# EAGLE design Mainboard_V1 (EAGLE 7.6.0)

## Sheet 1 of 2
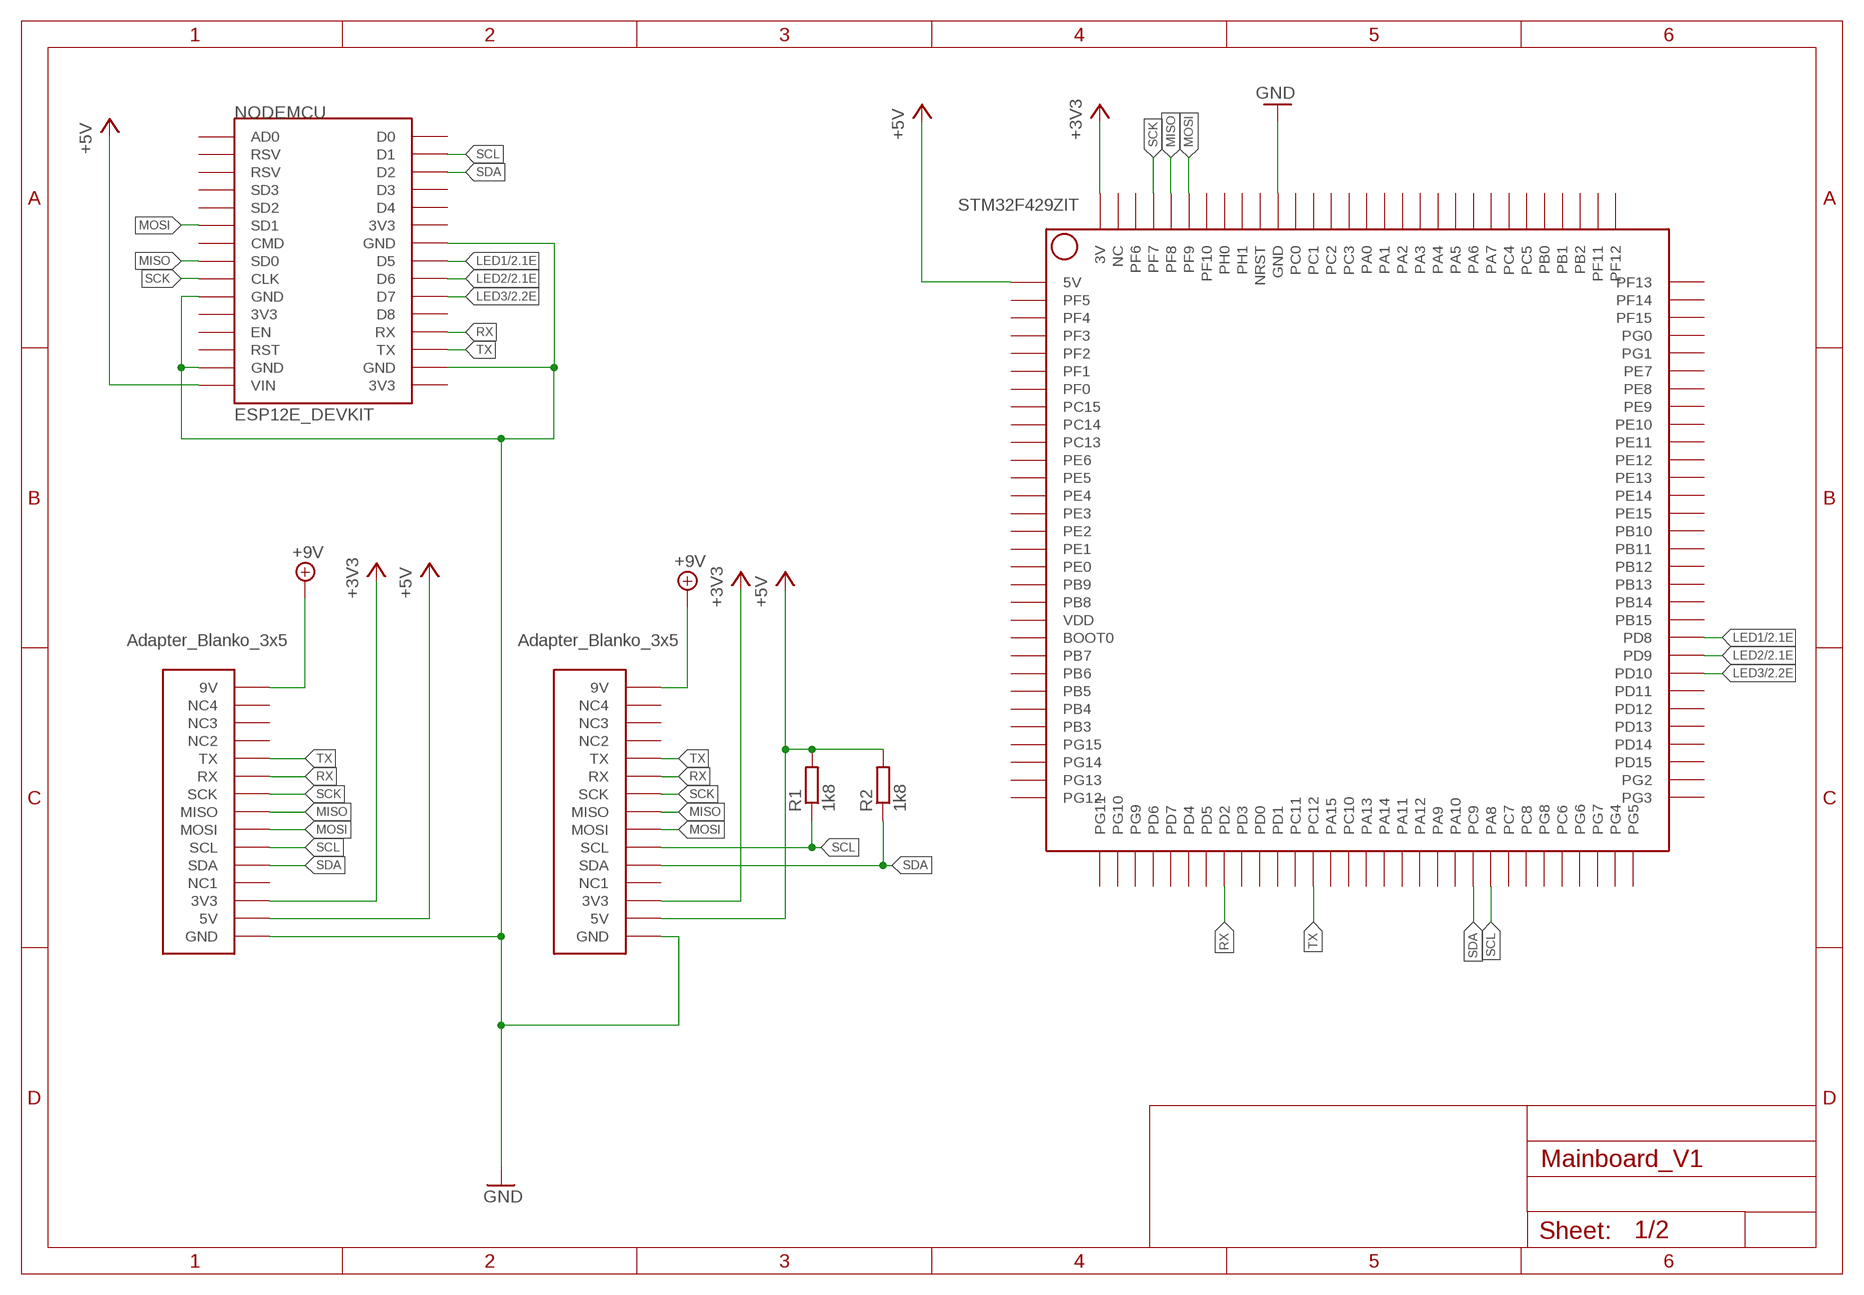
[diagram p0: schematic, sheet 1]

### Parts
NODEMCU  ESP12E_DEVKIT  [ESP12E_DEVKIT]
R1  1k8  R-EU_R0805  [R0805]
R2  1k8  R-EU_R0805  [R0805]
U$1  STM32F429ZIT  [STM32F429ZIT]
U$2  ADAPTER_BLANKO_3X5B1  [ADAPTER_BLANKO_3X5_B1]
U$3  ADAPTER_BLANKO_3X5B1  [ADAPTER_BLANKO_3X5_B1]

### Nets
+3V3: U$1.3V U$1.3V1(3V) U$2.3V3 U$2.3V3_1(3V3) U$3.3V3 U$3.3V3_1(3V3) ; also sheet 2
+5V: NODEMCU.VIN R1.2 R2.2 U$1.5V U$1.5V1(5V) U$2.5V U$2.5V_1(5V) U$3.5V U$3.5V_1(5V) ; also sheet 2
+9V: U$2.9V U$2.9V_1(9V) U$3.9V U$3.9V_1(9V) ; also sheet 2
GND: NODEMCU.GND@0(GND) NODEMCU.GND@1(GND) NODEMCU.GND@2(GND) NODEMCU.GND@3(GND) U$1.GND U$1.GND1(GND) U$1.GND2(GND) U$1.GND3(GND) U$1.GND4(GND) U$1.GND5(GND) U$2.GND U$2.GND1(GND) U$2.GND2(GND) U$2.GND3(GND) U$3.GND U$3.GND1(GND) U$3.GND2(GND) U$3.GND3(GND) ; also sheet 2
LED1: NODEMCU.D5 U$1.PD8 ; also sheet 2
LED2: NODEMCU.D6 U$1.PD9 ; also sheet 2
LED3: NODEMCU.D7 U$1.PD10 ; also sheet 2
MISO: NODEMCU.SD0 U$1.PF8 U$2.MISO U$2.MISO_1(MISO) U$3.MISO U$3.MISO_1(MISO)
MOSI: NODEMCU.SD1 U$1.PF9 U$2.MOSI U$2.MOSI_1(MOSI) U$3.MOSI U$3.MOSI_1(MOSI)
RX: NODEMCU.RX U$1.PD2 U$2.RX U$2.RX_1(RX) U$3.RX U$3.RX_1(RX)
SCK: NODEMCU.CLK U$1.PF7 U$2.SCK U$2.SCK_1(SCK) U$3.SCK U$3.SCK_1(SCK)
SCL: NODEMCU.D1 R1.1 U$1.PA8 U$2.SCL U$2.SCL_1(SCL) U$3.SCL U$3.SCL_1(SCL)
SDA: NODEMCU.D2 R2.1 U$1.PC9 U$2.SDA U$2.SDA_1(SDA) U$3.SDA U$3.SDA_1(SDA)
TX: NODEMCU.TX U$1.PC12 U$2.TX U$2.TX_1(TX) U$3.TX U$3.TX_1(TX)
Unconnected: NODEMCU.3V3@0(3V3) NODEMCU.3V3@1(3V3) NODEMCU.3V3@2(3V3) NODEMCU.AD0 NODEMCU.CMD NODEMCU.D0 NODEMCU.D3 NODEMCU.D4 NODEMCU.D8 NODEMCU.EN NODEMCU.RST NODEMCU.RSV@0(RSV) NODEMCU.RSV@1(RSV) NODEMCU.SD2 NODEMCU.SD3 U$1.BOOT0 U$1.NC U$1.NRST U$1.PA0 U$1.PA1 U$1.PA2 U$1.PA3 U$1.PA4 U$1.PA5 U$1.PA6 U$1.PA7 U$1.PA9 U$1.PA10 U$1.PA11 U$1.PA12 U$1.PA13 U$1.PA14 U$1.PA15 U$1.PB0 U$1.PB1 U$1.PB2 U$1.PB3 U$1.PB4 U$1.PB5 U$1.PB6 U$1.PB7 U$1.PB8 U$1.PB9 U$1.PB10 U$1.PB11 U$1.PB12 U$1.PB13 U$1.PB14 U$1.PB15 U$1.PC0 U$1.PC1 U$1.PC2 U$1.PC3 U$1.PC4 U$1.PC5 U$1.PC6 U$1.PC7 U$1.PC8 U$1.PC10 U$1.PC11 U$1.PC13 U$1.PC14 U$1.PC15 U$1.PD0 U$1.PD1 U$1.PD3 U$1.PD4 U$1.PD5 U$1.PD6 U$1.PD7 U$1.PD11 U$1.PD12 U$1.PD13 U$1.PD14 U$1.PD15 U$1.PE0 U$1.PE1 U$1.PE2 U$1.PE3 U$1.PE4 U$1.PE5 U$1.PE6 U$1.PE7 U$1.PE8 U$1.PE9 U$1.PE10 U$1.PE11 U$1.PE12 U$1.PE13 U$1.PE14 U$1.PE15 U$1.PF0 U$1.PF1 U$1.PF2 U$1.PF3 U$1.PF4 U$1.PF5 U$1.PF6 U$1.PF10 U$1.PF11 U$1.PF12 U$1.PF13 U$1.PF14 U$1.PF15 U$1.PG0 U$1.PG1 U$1.PG2 U$1.PG3 U$1.PG4 U$1.PG5 U$1.PG6 U$1.PG7 U$1.PG8 U$1.PG9 U$1.PG10 U$1.PG11 U$1.PG12 U$1.PG13 U$1.PG14 U$1.PG15 U$1.PH0 U$1.PH1 U$1.VDD U$2.NC1 U$2.NC2 U$2.NC3 U$2.NC4 U$2.NC5(NC1) U$2.NC6(NC2) U$2.NC7(NC3) U$2.NC8(NC4) U$3.NC1 U$3.NC2 U$3.NC3 U$3.NC4 U$3.NC5(NC1) U$3.NC6(NC2) U$3.NC7(NC3) U$3.NC8(NC4)

## Sheet 2 of 2
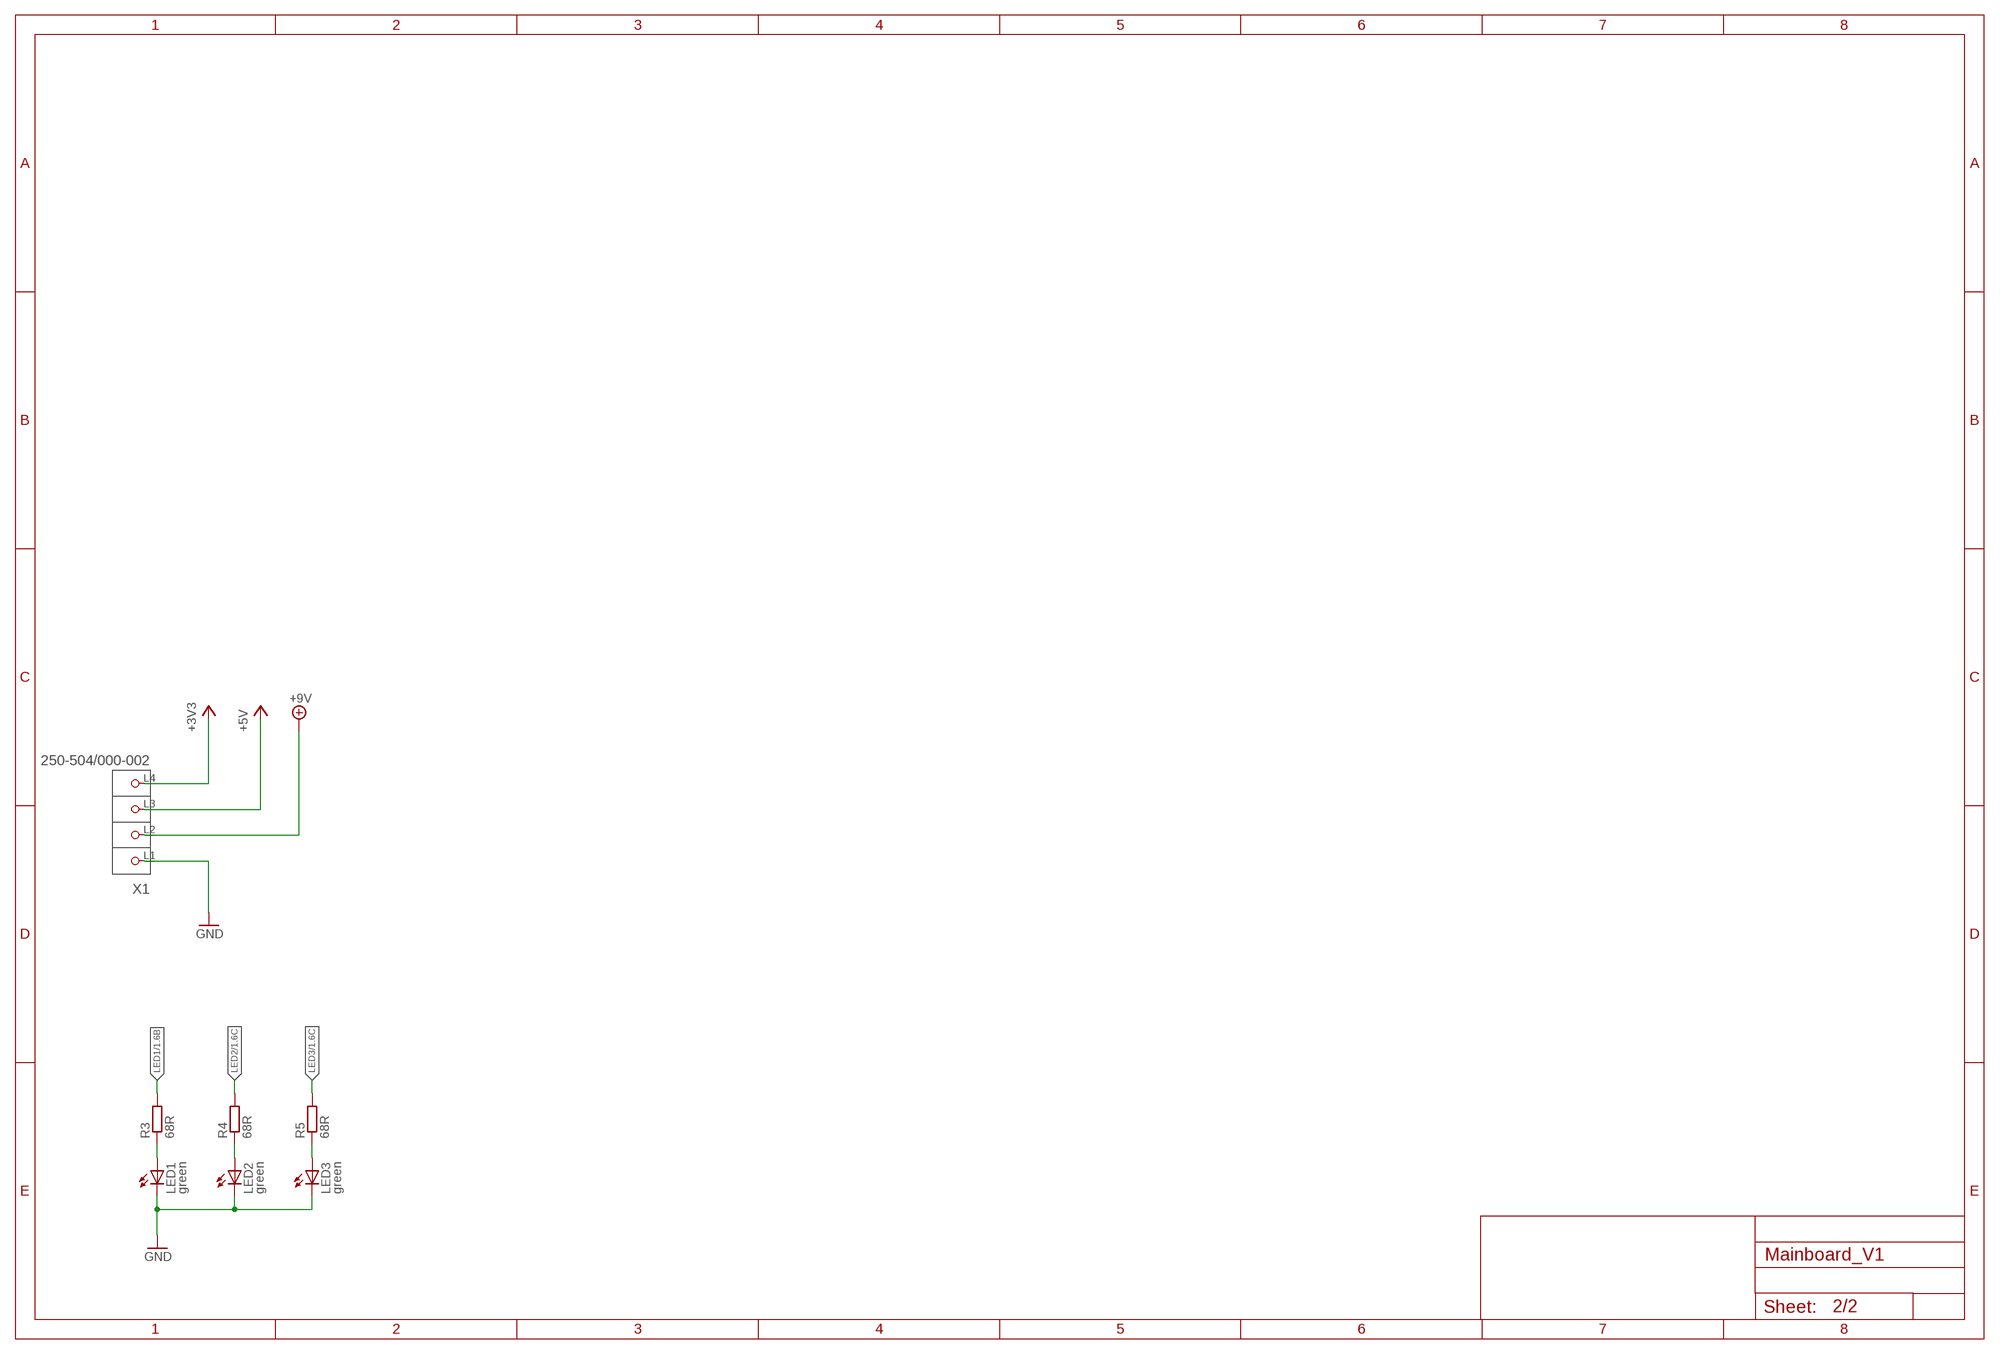
[diagram p1: schematic, sheet 2]

### Parts
LED1  green  LEDCHIP-LED0805  [CHIP-LED0805]
LED2  green  LEDCHIP-LED0805  [CHIP-LED0805]
LED3  green  LEDCHIP-LED0805  [CHIP-LED0805]
R3  68R  R-EU_R0805W  [R0805W]
R4  68R  R-EU_R0805W  [R0805W]
R5  68R  R-EU_R0805W  [R0805W]
X1  250-504/000-002  [P-250-504]

### Nets
+3V3: X1.L4(P4) ; also sheet 1
+5V: X1.L3(P3) ; also sheet 1
+9V: X1.L2(P2) ; also sheet 1
GND: LED1.C LED2.C LED3.C X1.L1(P1) ; also sheet 1
LED1: R3.2 ; also sheet 1
LED2: R4.2 ; also sheet 1
LED3: R5.2 ; also sheet 1
N$1: LED1.A R3.1
N$2: LED2.A R4.1
N$3: LED3.A R5.1

## Library data of the parts
LED1-LED3 = led:LED: LED OSRAM: - CHIPLED LG R971, LG N971, LY N971, LG Q971, LY Q971, LO R971, LY R971 LH N974, LH R974 LS Q976, LO Q976, LY Q976 LO Q996 - Hyper CHIPLED LW Q18S LB Q993, LB Q99A, LB R99A - SideLED LS A670, LO A670, LY A670, LG A670, LP A670 LB A673, LV A673, LT A673, LW A673 LH A674 LY A675 LS A676, LA A676, LO A676, LY A676, LW A676 LS A679, LY A679, LG A679 - Hyper Micro SIDELED® LS Y876, LA Y876, LO Y876, LY Y876 LT Y87S - SmartLED LW L88C, LW L88S LB L89C, LB L89S, LG L890 LS L89K, LO L89K, LY L89K LS L896, LA L896, LO L896, LY L896 - TOPLED LS T670, LO T670, LY T670, LG T670, LP T670 LSG T670, LSP T670, LSY T670, LOP T670, LYG T670 LG T671, LOG T671, LSG T671 LB T673, LV T673, LT T673, LW T673 LH T674 LS T676, LA T676, LO T676, LY T676, LB T676, LH T676, LSB T676, LW T676 LB T67C, LV T67C, LT T67C, LS T67K, LO T67K, LY T67K, LW E67C LS E67B, LA E67B, LO E67B, LY E67B, LB E67C, LV E67C, LT E67C LW T67C LS T679, LY T679, LG T679 LS T770, LO T770, LY T770, LG T770, LP T770 LB T773, LV T773, LT T773, LW T773 LH T774 LS E675, LA E675, LY E675, LS T675 LS T776, LA T776, LO T776, LY T776, LB T776 LHGB T686 LT T68C, LB T68C - Hyper Mini TOPLED® LB M676 - Mini TOPLED Santana® LG M470 LS M47K, LO M47K, LY M47K Source: http://www.osram.convergy.de LUXEON: - LUMILED® LXK2-PW12-R00, LXK2-PW12-S00, LXK2-PW14-U00, LXK2-PW14-V00 LXK2-PM12-R00, LXK2-PM12-S00, LXK2-PM14-U00 LXK2-PE12-Q00, LXK2-PE12-R00, LXK2-PE12-S00, LXK2-PE14-T00, LXK2-PE14-U00 LXK2-PB12-K00, LXK2-PB12-L00, LXK2-PB12-M00, LXK2-PB14-N00, LXK2-PB14-P00, LXK2-PB14-Q00 LXK2-PR12-L00, LXK2-PR12-M00, LXK2-PR14-Q00, LXK2-PR14-R00 LXK2-PD12-Q00, LXK2-PD12-R00, LXK2-PD12-S00 LXK2-PH12-R00, LXK2-PH12-S00 LXK2-PL12-P00, LXK2-PL12-Q00, LXK2-PL12-R00 Source: www.luxeon.com KINGBRIGHT: KA-3528ASYC Source: www.kingbright.com
NODEMCU = ESP12E_DEVKIT:ESP12E_DEVKIT: ESP12E DEVKIT BOARD
R1-R5 = rcl:R-EU_: RESISTOR, European symbol
U$1 = Tim:STM32F429ZIT
U$2 U$3 = Tim:ADAPTER_BLANKO_3X5: B1 = Beschriftung innen B2 = Beschriftung aussen
X1 = IDWlib:250-504/000-002: Serie 250, Stand: 01.01.2012. Die jeweils aktuellen Daten zu diesem Artikel finden Sie in unserem Produktkatalog, den Sie unter www.wago.com einsehen können. As of: 01/01/2012. Please find the newest data for this article in our product catalogue, which can be viewed under www.wago.com.

## Board
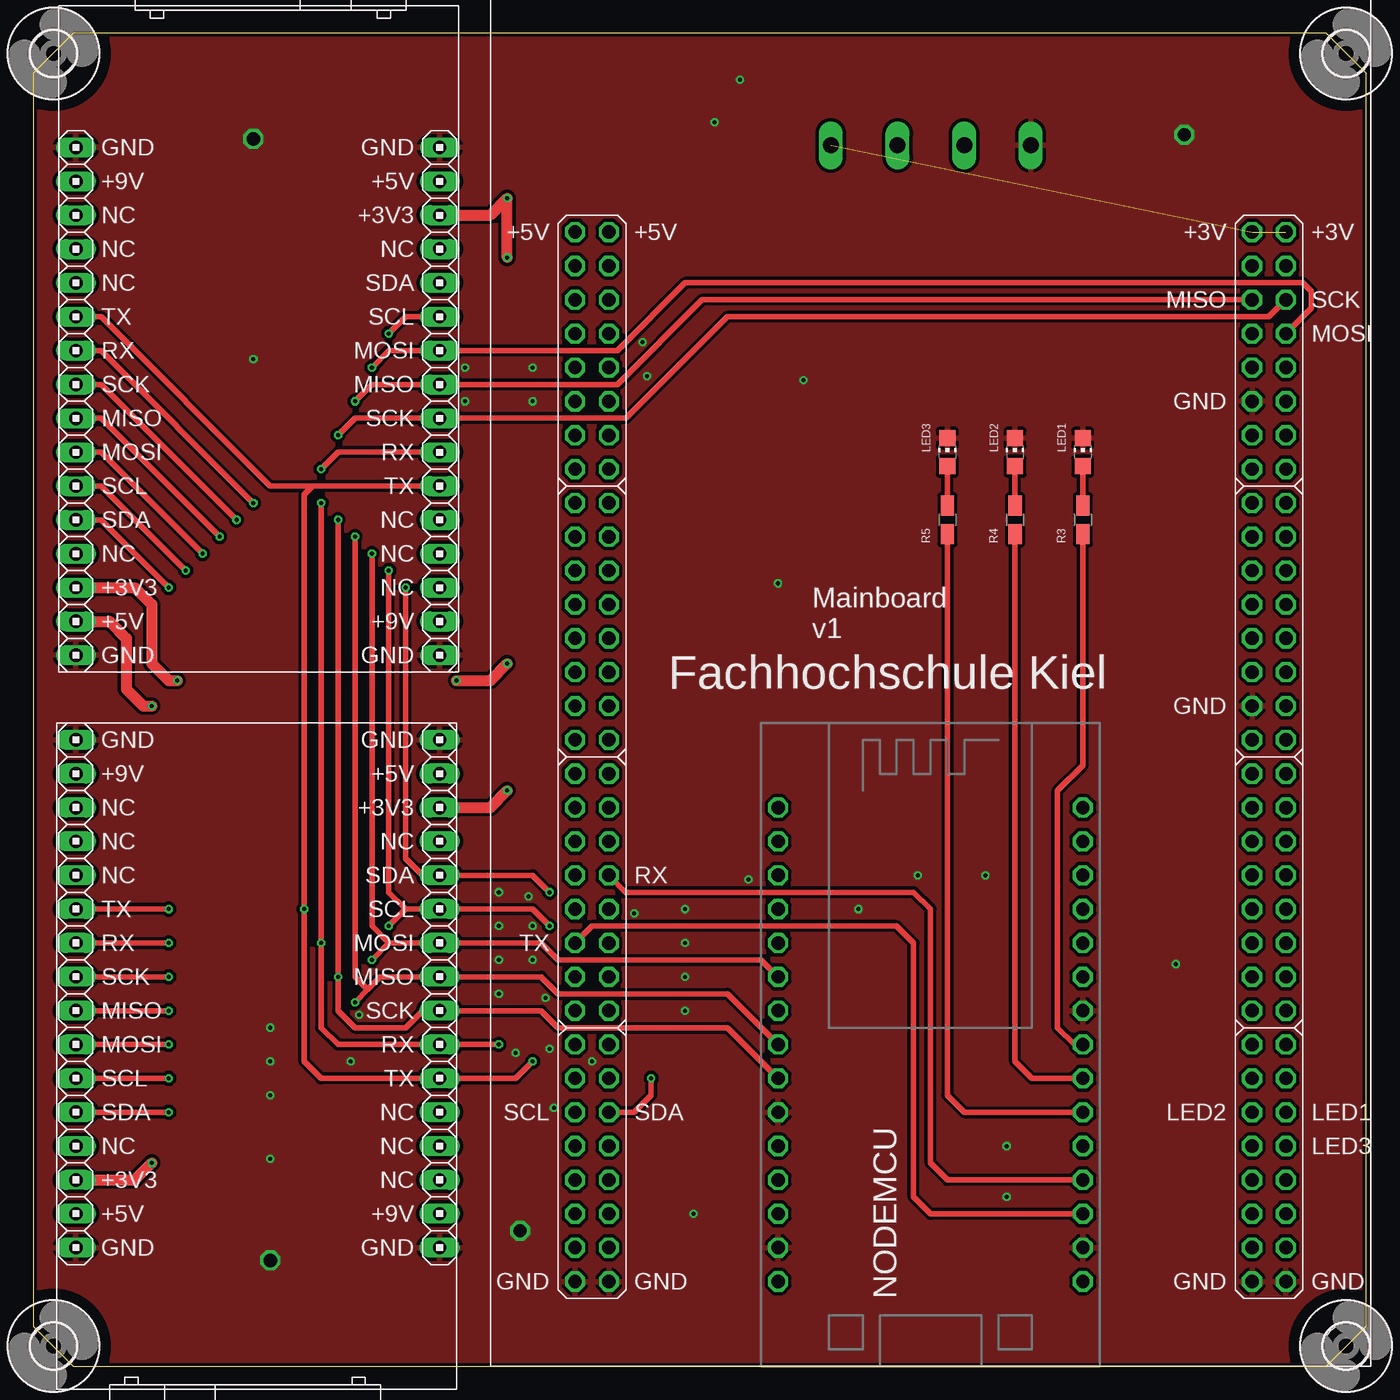
[diagram p2: board, top side]
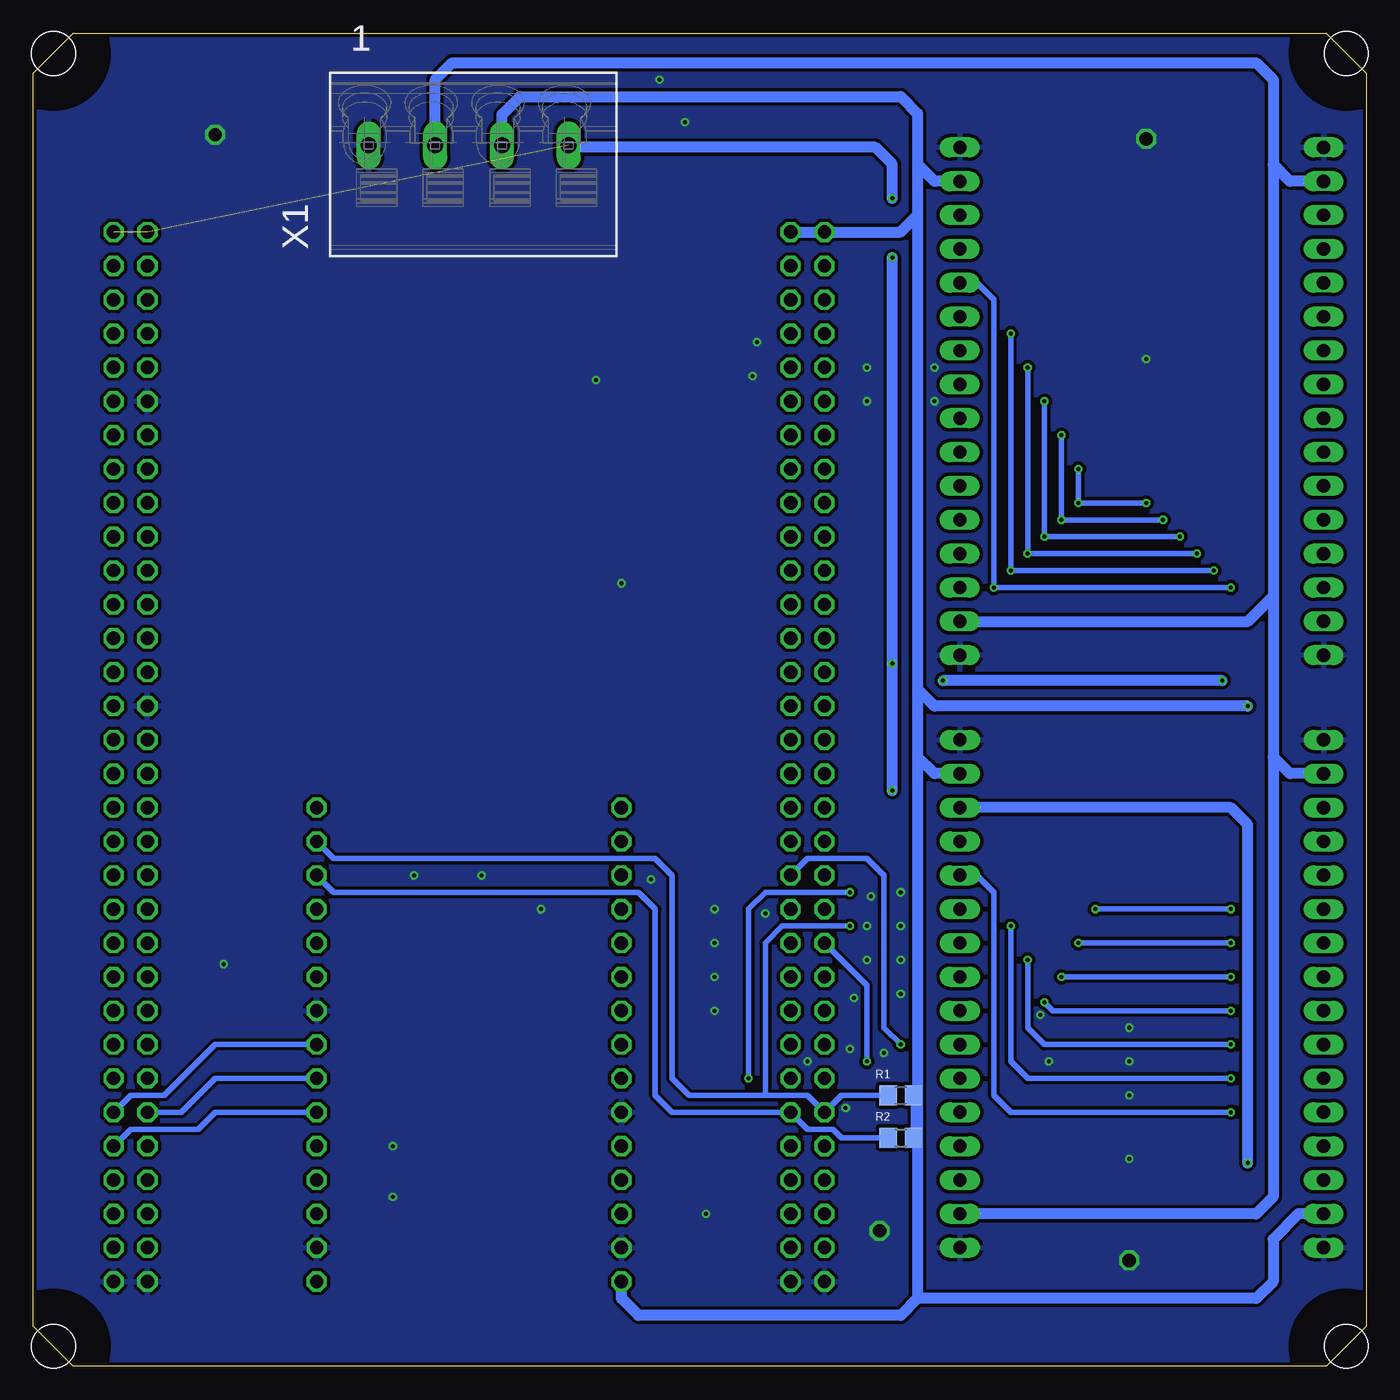
[diagram p3: board, bottom side, seen from below]

Size 100 x 100 mm. Coordinates in mm from the lower left corner, seen from the top.
Outline: 3,0 97,0 100,3 100,97 97,100 3,100 0,97 0,3 3,0
Copper layers (1*16): Top 0.035mm / dielectric 1.5mm / Bottom 0.035mm
Design rules "dirt_cheap_dirty_boards.v1": minimum track width 5mil, minimum drill 12mil, track to track 5mil, track to pad 5mil, pad to pad 5mil, via to via 5mil, smd to smd 0mil, copper to edge 10mil, drill to drill 10mil, minimum pad ring 10mil, minimum via ring 6mil, stop-mask expansion 2mil, vias tented up to drill 25mil, thermal gap 10mil

### Footprints (pad centres in the part's own frame; a part is rotated, then mirrored left to right if it is on the bottom)
CHIP-LED0805 = smd 1.2 x 1.2: A 0,-1.05; C 0,1.05
ESP12E_DEVKIT = drill 1 octagon: 3V3@0 -11.43,-7.62; 3V3@1 11.43,5.08; 3V3@2 11.43,-17.78; AD0 -11.43,17.78; CLK -11.43,-2.54; CMD -11.43,2.54; D0 11.43,17.78; D1 11.43,15.24; D2 11.43,12.7; D3 11.43,10.16; D4 11.43,7.62; D5 11.43,0; D6 11.43,-2.54; D7 11.43,-5.08; D8 11.43,-7.62; EN -11.43,-10.16; GND@0 -11.43,-5.08; GND@1 -11.43,-15.24; GND@2 11.43,2.54; GND@3 11.43,-15.24; RST -11.43,-12.7; RSV@0 -11.43,15.24; RSV@1 -11.43,12.7; RX 11.43,-10.16; SD0 -11.43,0; SD1 -11.43,5.08; SD2 -11.43,7.62; SD3 -11.43,10.16; TX 11.43,-12.7; VIN -11.43,-17.78
R0805 = smd 1.3 x 1.5: 1 -0.95,0; 2 0.95,0
R0805W = smd 1.5 x 1: 1 -1.052,0; 2 1.052,0
STM32F429ZIT = drill 1 octagon: 3V -6.35,85.089; 3V1 -8.89,85.089; 5V -59.69,85.089; 5V1 -57.15,85.089; BOOT0 -59.69,59.689; GND -59.69,6.349; GND1 -57.15,6.349; GND2 -6.35,6.349; GND3 -8.89,6.349; GND4 -8.89,49.529; GND5 -8.89,72.389; NC -6.35,82.549; NRST -6.35,72.389; PA0 -6.35,64.769; PA1 -8.89,64.769; PA2 -6.35,62.229; PA3 -8.89,62.229; PA4 -6.35,59.689; PA5 -8.89,59.689; PA6 -6.35,57.149; PA7 -8.89,57.149; PA8 -59.69,19.049; PA9 -57.15,21.589; PA10 -59.69,21.589; PA11 -57.15,24.129; PA12 -59.69,24.129; PA13 -57.15,26.669; PA14 -59.69,26.669; PA15 -57.15,29.209; PB0 -6.35,52.069; PB1 -8.89,52.069; PB2 -6.35,49.529; PB3 -57.15,52.069; PB4 -59.69,54.609; PB5 -57.15,54.609; PB6 -59.69,57.149; PB7 -57.15,57.149; PB8 -59.69,62.229; PB9 -57.15,62.229; PB10 -6.35,26.669; PB11 -8.89,26.669; PB12 -6.35,24.129; PB13 -8.89,24.129; PB14 -6.35,21.589; PB15 -8.89,21.589; PC0 -6.35,69.849; PC1 -8.89,69.849; PC2 -6.35,67.309; PC3 -8.89,67.309; PC4 -6.35,54.609; PC5 -8.89,54.609; PC6 -59.69,13.969; PC7 -57.15,16.509; PC8 -59.69,16.509; PC9 -57.15,19.049; PC10 -59.69,29.209; PC11 -57.15,31.749; PC12 -59.69,31.749; PC13 -57.15,72.389; PC14 -59.69,74.929; PC15 -57.15,74.929; PD0 -57.15,34.289; PD1 -59.69,34.289; PD2 -57.15,36.829; PD3 -59.69,36.829; PD4 -57.15,39.369; PD5 -59.69,39.369; PD6 -57.15,41.909; PD7 -59.69,41.909; PD8 -6.35,19.049; PD9 -8.89,19.049; PD10 -6.35,16.509; PD11 -8.89,16.509; PD12 -6.35,13.969; PD13 -8.89,13.969; PD14 -6.35,11.429; PD15 -8.89,11.429; PE0 -59.69,64.769; PE1 -57.15,64.769; PE2 -59.69,67.309; PE3 -57.15,67.309; PE4 -59.69,69.849; PE5 -57.15,69.849; PE6 -59.69,72.389; PE7 -8.89,39.369; PE8 -6.35,36.829; PE9 -8.89,36.829; PE10 -6.35,34.289; PE11 -8.89,34.289; PE12 -6.35,31.749; PE13 -8.89,31.749; PE14 -6.35,29.209; PE15 -8.89,29.209; PF0 -59.69,77.469; PF1 -57.15,77.469; PF2 -59.69,80.009; PF3 -57.15,80.009; PF4 -59.69,82.549; PF5 -57.15,82.549; PF6 -8.89,82.549; PF7 -6.35,80.009; PF8 -8.89,80.009; PF9 -6.35,77.469; PF10 -8.89,77.469; PF11 -6.35,46.989; PF12 -8.89,46.989; PF13 -6.35,44.449; PF14 -8.89,44.449; PF15 -6.35,41.909; PG0 -8.89,41.909; PG1 -6.35,39.369; PG2 -6.35,8.889; PG3 -8.89,8.889; PG4 -57.15,8.889; PG5 -59.69,8.889; PG6 -57.15,11.429; PG7 -59.69,11.429; PG8 -57.15,13.969; PG9 -59.69,44.449; PG10 -57.15,44.449; PG11 -59.69,46.989; PG12 -57.15,46.989; PG13 -59.69,49.529; PG14 -57.15,49.529; PG15 -59.69,52.069; PH0 -6.35,74.929; PH1 -8.89,74.929; VDD -57.15,59.689
ADAPTER_BLANKO_3X5_B1 = drill 1 long: 3V3 1.278,6.349; 3V3_1 28.566,34.289; 5V 1.278,3.809; 5V_1 28.566,36.829; 9V 1.278,36.829; 9V_1 28.566,3.809; GND 1.278,1.269; GND1 1.278,39.369; GND2 28.566,39.369; GND3 28.566,1.269; MISO 1.278,19.049; MISO_1 28.566,21.589; MOSI 1.278,16.509; MOSI_1 28.566,24.129; NC1 1.278,8.889; NC2 1.278,29.209; NC3 1.278,31.749; NC4 1.278,34.289; NC5 28.566,31.749; NC6 28.566,11.429; NC7 28.566,8.889; NC8 28.566,6.349; RX 1.278,24.129; RX_1 28.566,16.509; SCK 1.278,21.589; SCK_1 28.566,19.049; SCL 1.278,13.969; SCL_1 28.566,26.669; SDA 1.278,11.429; SDA_1 28.566,29.209; TX 1.278,26.669; TX_1 28.566,13.969
3,3 = hole 3.3: 0,0
P-250-504 = drill 1.2 long: L1 1.425,7.85; L2 1.425,2.85; L3 1.425,-2.15; L4 1.425,-7.15

### Placement (x,y rotation side)
LED1  78.74,68.58 0 top
LED2  73.66,68.58 0 top
LED3  68.58,68.58 0 top
NODEMCU  67.31,24.13 0 top
R1  34.92,20.32 0 bottom
R2  34.92,17.14 0 bottom
R3  78.74,63.5 270 top
R4  73.66,63.5 270 top
R5  68.58,63.5 270 top
U$1  100.33,0 0 top
U$2  1.92,52.07 0 top
U$3  31.76,48.26 180 top
U$4  [3,3]  1.5,98.5 0 top
U$5  [3,3]  1.5,1.5 0 top
U$6  [3,3]  98.5,1.5 0 top
U$7  [3,3]  98.5,98.5 0 top
X1  66.99,90.17 90 bottom

### Tracks (layer width: path | path; a pad name or v marks a point on that pad's centre or on a via)
+3V3  (via drill 0.3)  (2 unrouted)
  Top 0.813: U$3.3V3 34.29,41.91 v35.56,43.18 | U$2.3V3_1 34.29,86.36 v35.56,87.63 v35.56,83.19 | U$2.3V3 7.62,58.42 8.89,57.15 8.89,52.7 10.16,51.44 v10.79,51.44 | v31.75,51.44 34.29,51.44 v35.56,52.7 | U$3.3V3_1 7.62,13.97 v8.89,15.24
  Bottom 0.813: X1.L4 59.69,91.44 36.83,91.44 35.56,90.17 v35.56,87.63 | v35.56,43.18 v35.56,52.7 v35.56,83.19 | v10.79,51.44 v31.75,51.44 | v8.89,15.24 8.89,40.64 10.16,41.91 U$3.3V3
+5V  (via drill 0.3)
  Top 0.813: U$2.5V 5.72,55.88 6.99,54.61 6.99,50.8 8.26,49.53 v8.89,49.53
  Bottom 0.406: 33.66,5.08 33.66,16.82 R2.2 R1.2
  Bottom 0.813: X1.L3 64.84,93.91 63.5,95.25 34.92,95.25 33.66,93.98 33.66,90.17 | 33.66,90.17 33.66,86.36 | 33.66,86.36 33.66,50.8 | 33.66,50.8 33.66,45.72 | 33.66,45.72 33.66,5.08 | 33.66,5.08 34.92,3.81 54.61,3.81 55.88,5.08 NODEMCU.VIN | U$3.5V_1 5.08,11.43 6.99,9.53 6.99,6.35 8.26,5.08 33.66,5.08 | U$3.5V 32.39,44.45 33.66,45.72 | U$2.5V_1 32.38,88.9 33.66,90.17 | U$1.5V1 U$1.5V 34.93,85.09 33.66,86.36 | v8.89,49.53 32.38,49.53 33.66,50.8
+9V
  Bottom 0.813: X1.L2 69.84,96.53 68.58,97.79 8.26,97.79 6.99,96.52 6.99,90.17 | U$2.9V 5.71,88.9 6.99,90.17 | 6.99,90.17 6.99,57.78 | 6.99,57.78 6.99,45.72 | 6.99,45.72 6.99,12.7 8.26,11.43 U$3.9V | U$3.9V_1 5.72,44.45 6.99,45.72 | U$2.9V_1 8.89,55.88 6.99,57.78
GND  (via drill 0.3, 1)
  other vias: 16.51,92.08 16.51,75.56 53.02,96.52 51.12,93.34 37.47,74.93 32.38,74.93 32.38,72.39 37.47,72.39 45.72,76.83 46.04,74.3 57.78,73.98 86.36,92.39 71.44,36.83 66.36,36.83 85.72,30.16 61.91,34.29 48.9,34.29 48.9,31.75 48.9,29.21 48.9,26.67 45.09,33.97 34.92,35.56 37.15,35.24 37.47,33.02 37.47,30.48 38.42,27.62 34.92,27.94 34.92,30.48 34.92,33.02 36.2,23.5 38.73,23.81 39.05,19.37 49.53,11.43 36.51,10.16 17.78,7.94 17.78,15.56 17.78,20.32 17.78,22.86 17.78,25.4 23.81,22.86 24.45,26.35 41.91,22.86 53.66,36.51 55.88,58.74 73.03,16.51 73.03,12.7
  pour Bottom (isolate 0.254, rank 2): 0,0 100.01,0 100.01,100.01 0,100.01
  pour Top (isolate 0.254, rank 2): 0,0 100.01,0 100.01,100.01 0,100.01
LED1
  Top 0.406: NODEMCU.D5 78.11,24.13 76.83,25.4 76.83,43.18 78.74,45.09 R3.2
  Bottom 0.406: U$1.PD8 92.71,20.32 90.17,20.32 86.36,24.13 NODEMCU.D5
LED2
  Top 0.406: R4.2 73.66,22.86 74.93,21.59 NODEMCU.D6
  Bottom 0.406: U$1.PD9 88.9,19.05 86.36,21.59 NODEMCU.D6
LED3
  Top 0.406: R5.2 68.58,20.32 69.85,19.05 NODEMCU.D7
  Bottom 0.406: NODEMCU.D7 86.36,19.05 87.63,17.78 92.71,17.78 U$1.PD10
MISO  (via drill 0.3)
  Top 0.406: NODEMCU.SD0 52.07,27.94 39.37,27.94 38.1,29.21 U$3.MISO 26.04,29.21 25.08,28.26 | U$3.MISO_1 v10.16,26.67 | 25.08,28.26 v24.13,27.3 | v24.13,72.39 25.4,73.66 U$2.MISO_1 43.81,73.66 50.16,80.01 U$1.PF8 | U$2.MISO 5.08,71.12 v13.97,62.23 | v24.13,62.23 24.13,29.21 25.08,28.26
  Bottom 0.406: v10.16,26.67 23.5,26.67 v24.13,27.3 | v24.13,72.39 v24.13,62.23 v13.97,62.23
MOSI  (via drill 0.3)
  Top 0.406: NODEMCU.SD1 54.61,30.48 39.37,30.48 38.1,31.75 U$3.MOSI 26.67,31.75 | U$3.MOSI_1 v10.16,24.13 | v25.4,30.48 26.67,31.75 | 26.67,31.75 25.4,33.02 v25.4,60.96 | v25.4,74.93 26.67,76.2 U$2.MOSI_1 43.81,76.2 48.9,81.28 95.25,81.28 95.89,80.64 95.89,79.38 U$1.PF9 | U$2.MOSI 5.08,68.58 v12.7,60.96
  Bottom 0.406: v10.16,24.13 24.13,24.13 25.4,25.4 v25.4,30.48 | v25.4,74.93 v25.4,60.96 v12.7,60.96
N$1
  Top 0.406: R3.1 LED1.A
N$2
  Top 0.406: R4.1 LED2.A
N$3
  Top 0.406: R5.1 LED3.A
RX  (via drill 0.3)
  Top 0.406: U$3.RX_1 v10.16,31.75 | v34.92,24.13 U$3.RX 22.86,24.13 21.59,25.4 v21.59,31.75 v21.59,64.77 | NODEMCU.RX 68.58,13.97 67.31,15.24 67.31,34.29 66.04,35.56 44.45,35.56 U$1.PD2 | U$2.RX_1 22.86,68.58 v21.59,67.31 | U$2.RX 5.08,76.2 v16.51,64.77
  Bottom 0.406: v10.16,31.75 v21.59,31.75 | v34.92,24.13 36.2,25.4 36.2,36.83 37.47,38.1 41.91,38.1 U$1.PD2 | v21.59,67.31 v21.59,64.77 v16.51,64.77
SCK  (via drill 0.3)
  Top 0.406: NODEMCU.CLK 52.07,25.4 39.37,25.4 38.1,26.67 U$3.SCK 29.21,26.67 27.94,25.4 24.13,25.4 22.86,26.67 v22.86,29.21 v22.86,63.5 | U$3.SCK_1 v10.16,29.21 | v22.86,69.85 24.13,71.12 U$2.SCK_1 44.45,71.12 52.07,78.74 92.71,78.74 U$1.PF7 | U$2.SCK 5.08,73.66 v15.24,63.5
  Bottom 0.406: v10.16,29.21 v22.86,29.21 | v22.86,69.85 v22.86,63.5 v15.24,63.5
SCL  (via drill 0.3)
  Top 0.406: v38.73,33.02 37.46,34.29 U$3.SCL 27.94,34.29 | U$3.SCL_1 v10.16,21.59 | v26.67,33.02 27.94,34.29 | 27.94,34.29 26.67,35.56 v26.67,59.69 | v26.67,77.47 27.94,78.74 U$2.SCL_1 | U$2.SCL 5.08,66.04 v11.43,59.69
  Bottom 0.406: R1.1 39.37,20.32 U$1.PA8 41.91,20.32 | NODEMCU.D1 77.47,38.1 53.34,38.1 52.07,36.83 52.07,21.59 50.8,20.32 45.09,20.32 | 45.09,20.32 41.91,20.32 | v10.16,21.59 25.4,21.59 26.67,22.86 v26.67,33.02 | v38.73,33.02 43.81,33.02 45.09,31.75 45.09,20.32 | 41.91,20.32 | v26.67,77.47 v26.67,59.69 v11.43,59.69
SDA  (via drill 0.3)
  Top 0.406: v38.73,35.56 37.46,36.83 U$3.SDA 29.21,36.83 27.94,38.1 v27.94,58.42 | U$3.SDA_1 v10.16,19.05 | v46.35,21.59 46.35,20.32 45.09,19.05 U$1.PC9 | U$2.SDA 5.08,63.5 v10.16,58.42
  Bottom 0.406: R2.1 39.37,17.14 40.01,17.78 41.91,17.78 U$1.PC9 52.07,19.05 53.34,20.32 53.34,34.29 54.61,35.56 77.47,35.56 NODEMCU.D2 | v38.73,35.56 45.09,35.56 46.35,34.29 v46.35,21.59 | v10.16,19.05 26.67,19.05 27.94,20.32 27.94,35.56 29.21,36.83 U$3.SDA | U$2.SDA_1 29.21,81.28 27.94,80.01 v27.94,58.42 v10.16,58.42
TX  (via drill 0.3)
  Top 0.406: v10.16,34.29 U$3.TX_1 | NODEMCU.TX 67.31,11.43 66.04,12.7 66.04,31.75 64.77,33.02 41.91,33.02 U$1.PC12 | v37.47,22.86 36.2,21.59 U$3.TX 21.59,21.59 20.32,22.86 v20.32,34.29 20.32,65.41 20.95,66.04 | U$2.TX_1 20.95,66.04 | U$2.TX 5.08,78.74 17.78,66.04 20.95,66.04
  Bottom 0.406: v20.32,34.29 v10.16,34.29 | v37.47,22.86 37.47,28.57 U$1.PC12

### Text on the board
tNames: Mainboard / v1 | Fachhochschule Kiel